# EAGLE design Nivel_superior (EAGLE 7.6.0)
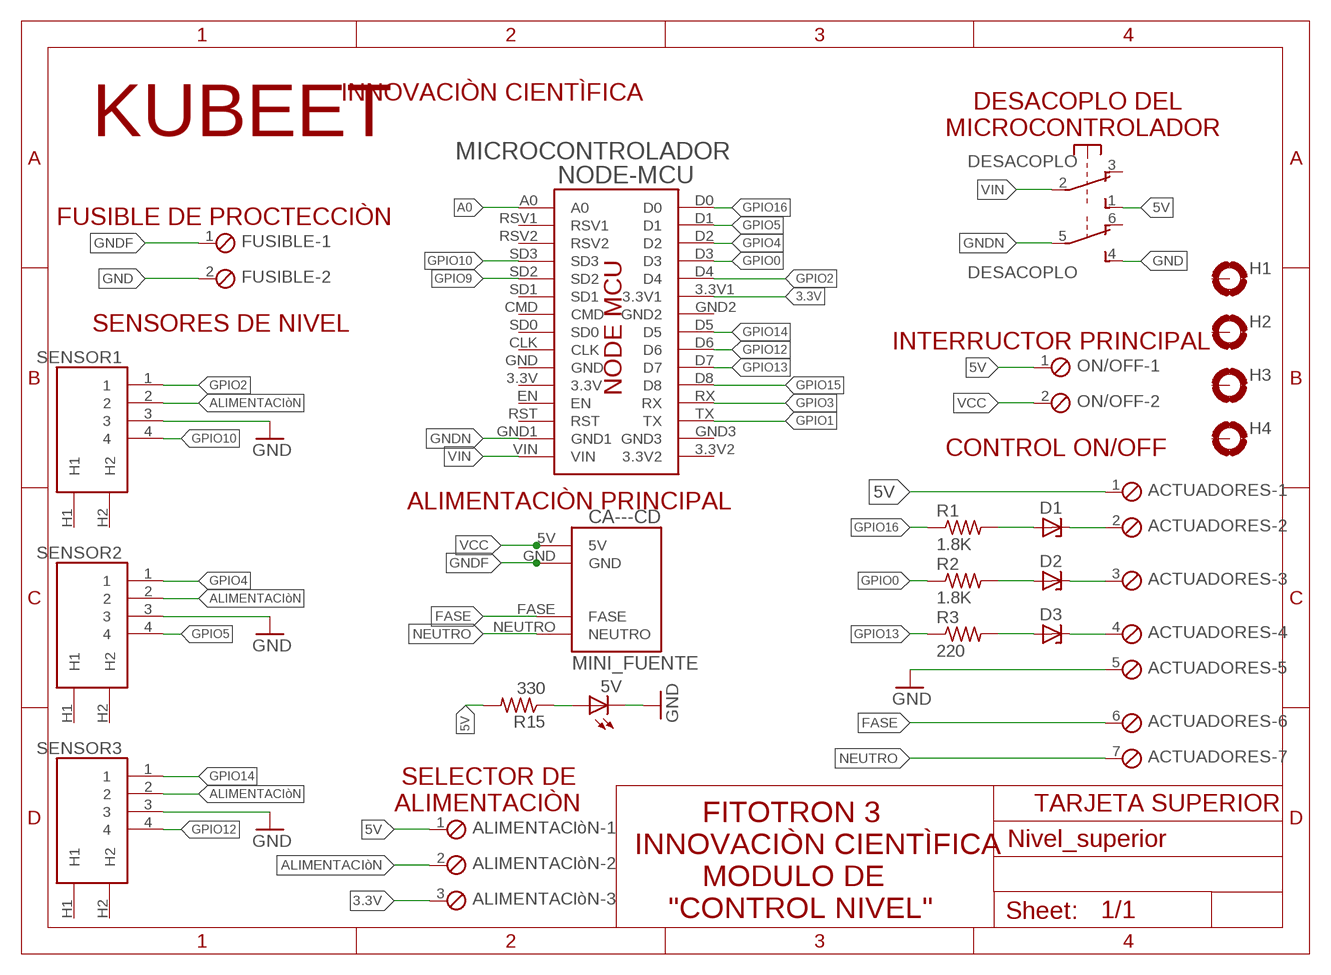
[diagram p0: schematic, sheet 1]

## Parts
5V  LED5MM  [LED5MM]
ACTUADORES  MPT7  [7POL254]
ALIMENTACIòN  MPT3  [3POL254]
CA---CD  MINI_FUENTE  MINI_FUENTE2  [MINI_FUENTE2]
D1  1N821  [DO35Z10]
D2  1N821  [DO35Z10]
D3  1N821  [DO35Z10]
DESACOPLO  9077-2  [9077-2]
FUSIBLE  MPT2  [2POL254]
H1  MOUNT-PAD-ROUND3.6  [3,6-PAD]
H2  MOUNT-PAD-ROUND3.6  [3,6-PAD]
H3  MOUNT-PAD-ROUND3.6  [3,6-PAD]
H4  MOUNT-PAD-ROUND3.6  [3,6-PAD]
MICROCONTROLADOR  NODE-MCU  [NODE-MCU]
ON/OFF  MPT2  [2POL254]
R1  1.8K  R-US_0207/7  [0207/7]
R2  1.8K  R-US_0207/7  [0207/7]
R3  220  R-US_0207/7  [0207/7]
R15  330  R-US_0207/7  [0207/7]
SENSOR1  RJ11  [RJ11]
SENSOR2  RJ11  [RJ11]
SENSOR3  RJ11  [RJ11]

## Nets
3.3V: ALIMENTACIòN.3 MICROCONTROLADOR.3.3V1
5V: ACTUADORES.1 ALIMENTACIòN.1 DESACOPLO.1(1:S) ON/OFF.1 R15.2
A0: MICROCONTROLADOR.A0
ALIMENTACIòN: ALIMENTACIòN.2 SENSOR1.2 SENSOR2.2 SENSOR3.2
FASE: ACTUADORES.6 CA---CD.FASE
GND: 5V.K(C) ACTUADORES.5 DESACOPLO.4(2:S) FUSIBLE.2 SENSOR1.3 SENSOR2.3 SENSOR3.3
GNDF: CA---CD.GND FUSIBLE.1
GNDN: DESACOPLO.5(2:P) MICROCONTROLADOR.GND1
GPIO0: MICROCONTROLADOR.D3 R2.1
GPIO1: MICROCONTROLADOR.TX
GPIO2: MICROCONTROLADOR.D4 SENSOR1.1
GPIO3: MICROCONTROLADOR.RX
GPIO4: MICROCONTROLADOR.D2 SENSOR2.1
GPIO5: MICROCONTROLADOR.D1 SENSOR2.4
GPIO9: MICROCONTROLADOR.SD2
GPIO10: MICROCONTROLADOR.SD3 SENSOR1.4
GPIO12: MICROCONTROLADOR.D6 SENSOR3.4
GPIO13: MICROCONTROLADOR.D7 R3.1
GPIO14: MICROCONTROLADOR.D5 SENSOR3.1
GPIO15: MICROCONTROLADOR.D8
GPIO16: MICROCONTROLADOR.D0 R1.1
N$5: D1.A R1.2
N$10: ACTUADORES.2 D1.C
N$13: D2.A R2.2
N$14: ACTUADORES.3 D2.C
N$18: 5V.A R15.1
N$22: D3.A R3.2
N$59: ACTUADORES.4 D3.C
NEUTRO: ACTUADORES.7 CA---CD.NEUTRO
VCC: CA---CD.5V ON/OFF.2
VIN: DESACOPLO.2(1:P) MICROCONTROLADOR.VIN
Unconnected: DESACOPLO.3(1:O) DESACOPLO.6(2:O) H1.B3,6(MOUNT) H2.B3,6(MOUNT) H3.B3,6(MOUNT) H4.B3,6(MOUNT) MICROCONTROLADOR.3.3V MICROCONTROLADOR.3.3V2 MICROCONTROLADOR.CLK MICROCONTROLADOR.CMD MICROCONTROLADOR.EN MICROCONTROLADOR.GND MICROCONTROLADOR.GND2 MICROCONTROLADOR.GND3 MICROCONTROLADOR.RST MICROCONTROLADOR.RSV1 MICROCONTROLADOR.RSV2 MICROCONTROLADOR.SD0 MICROCONTROLADOR.SD1 SENSOR1.H1 SENSOR1.H2 SENSOR2.H1 SENSOR2.H2 SENSOR3.H1 SENSOR3.H2

## Notes on the sheet
- INNOVACIÒN CIENTÌFICA
- KUBEET
- DESACOPLO DEL
  MICROCONTROLADOR
- FUSIBLE DE PROCTECCIÒN
- SENSORES DE NIVEL
- INTERRUCTOR PRINCIPAL
- CONTROL ON/OFF
- ALIMENTACIÒN PRINCIPAL
- SELECTOR DE 
  ALIMENTACIÒN
- TARJETA SUPERIOR
- FITOTRON 3
  INNOVACIÒN CIENTÌFICA
          MODULO DE 
      "CONTROL NIVEL"

## Library data of the parts
5V = led:LED: LED OSRAM: - CHIPLED LG R971, LG N971, LY N971, LG Q971, LY Q971, LO R971, LY R971 LH N974, LH R974 LS Q976, LO Q976, LY Q976 LO Q996 - Hyper CHIPLED LW Q18S LB Q993, LB Q99A, LB R99A - SideLED LS A670, LO A670, LY A670, LG A670, LP A670 LB A673, LV A673, LT A673, LW A673 LH A674 LY A675 LS A676, LA A676, LO A676, LY A676, LW A676 LS A679, LY A679, LG A679 - Hyper Micro SIDELED® LS Y876, LA Y876, LO Y876, LY Y876 LT Y87S - SmartLED LW L88C, LW L88S LB L89C, LB L89S, LG L890 LS L89K, LO L89K, LY L89K LS L896, LA L896, LO L896, LY L896 - TOPLED LS T670, LO T670, LY T670, LG T670, LP T670 LSG T670, LSP T670, LSY T670, LOP T670, LYG T670 LG T671, LOG T671, LSG T671 LB T673, LV T673, LT T673, LW T673 LH T674 LS T676, LA T676, LO T676, LY T676, LB T676, LH T676, LSB T676, LW T676 LB T67C, LV T67C, LT T67C, LS T67K, LO T67K, LY T67K, LW E67C LS E67B, LA E67B, LO E67B, LY E67B, LB E67C, LV E67C, LT E67C LW T67C LS T679, LY T679, LG T679 LS T770, LO T770, LY T770, LG T770, LP T770 LB T773, LV T773, LT T773, LW T773 LH T774 LS E675, LA E675, LY E675, LS T675 LS T776, LA T776, LO T776, LY T776, LB T776 LHGB T686 LT T68C, LB T68C - Hyper Mini TOPLED® LB M676 - Mini TOPLED Santana® LG M470 LS M47K, LO M47K, LY M47K Source: http://www.osram.convergy.de LUXEON: - LUMILED® LXK2-PW12-R00, LXK2-PW12-S00, LXK2-PW14-U00, LXK2-PW14-V00 LXK2-PM12-R00, LXK2-PM12-S00, LXK2-PM14-U00 LXK2-PE12-Q00, LXK2-PE12-R00, LXK2-PE12-S00, LXK2-PE14-T00, LXK2-PE14-U00 LXK2-PB12-K00, LXK2-PB12-L00, LXK2-PB12-M00, LXK2-PB14-N00, LXK2-PB14-P00, LXK2-PB14-Q00 LXK2-PR12-L00, LXK2-PR12-M00, LXK2-PR14-Q00, LXK2-PR14-R00 LXK2-PD12-Q00, LXK2-PD12-R00, LXK2-PD12-S00 LXK2-PH12-R00, LXK2-PH12-S00 LXK2-PL12-P00, LXK2-PL12-Q00, LXK2-PL12-R00 Source: www.luxeon.com KINGBRIGHT: KA-3528ASYC Source: www.kingbright.com
ACTUADORES = con-phoenix-254:MPT7: PHOENIX CONNECTOR; OC_FARNELL: unknown; OC_NEWARK: unknown
ALIMENTACIòN = con-phoenix-254:MPT3: PHOENIX CONNECTOR; OC_FARNELL: unknown; OC_NEWARK: unknown
CA---CD = CONECTORES RODAS:MINI_FUENTE2
D1-D3 = diode:1N821: Reference DIODE temperature compensated, 6,2 V
DESACOPLO = switch-misc:9077-2: MARQUARDT SWITCH 9077.0200 Distributor: Buerklin <https://www.buerklin.com/default.asp?event=ShowArtikel%2812G2822%29&l=d&jump=ArtNr_12G2822>
FUSIBLE ON/OFF = con-phoenix-254:MPT2: PHOENIX CONNECTOR; OC_FARNELL: unknown; OC_NEWARK: unknown
H1-H4 = holes:MOUNT-PAD-ROUND: MOUNTING PAD, round
MICROCONTROLADOR = Arduinos:NODE-MCU
R1-R3 R15 = rcl:R-US_: RESISTOR, American symbol
SENSOR1-SENSOR3 = CONECTORES RODAS:RJ11

## Board
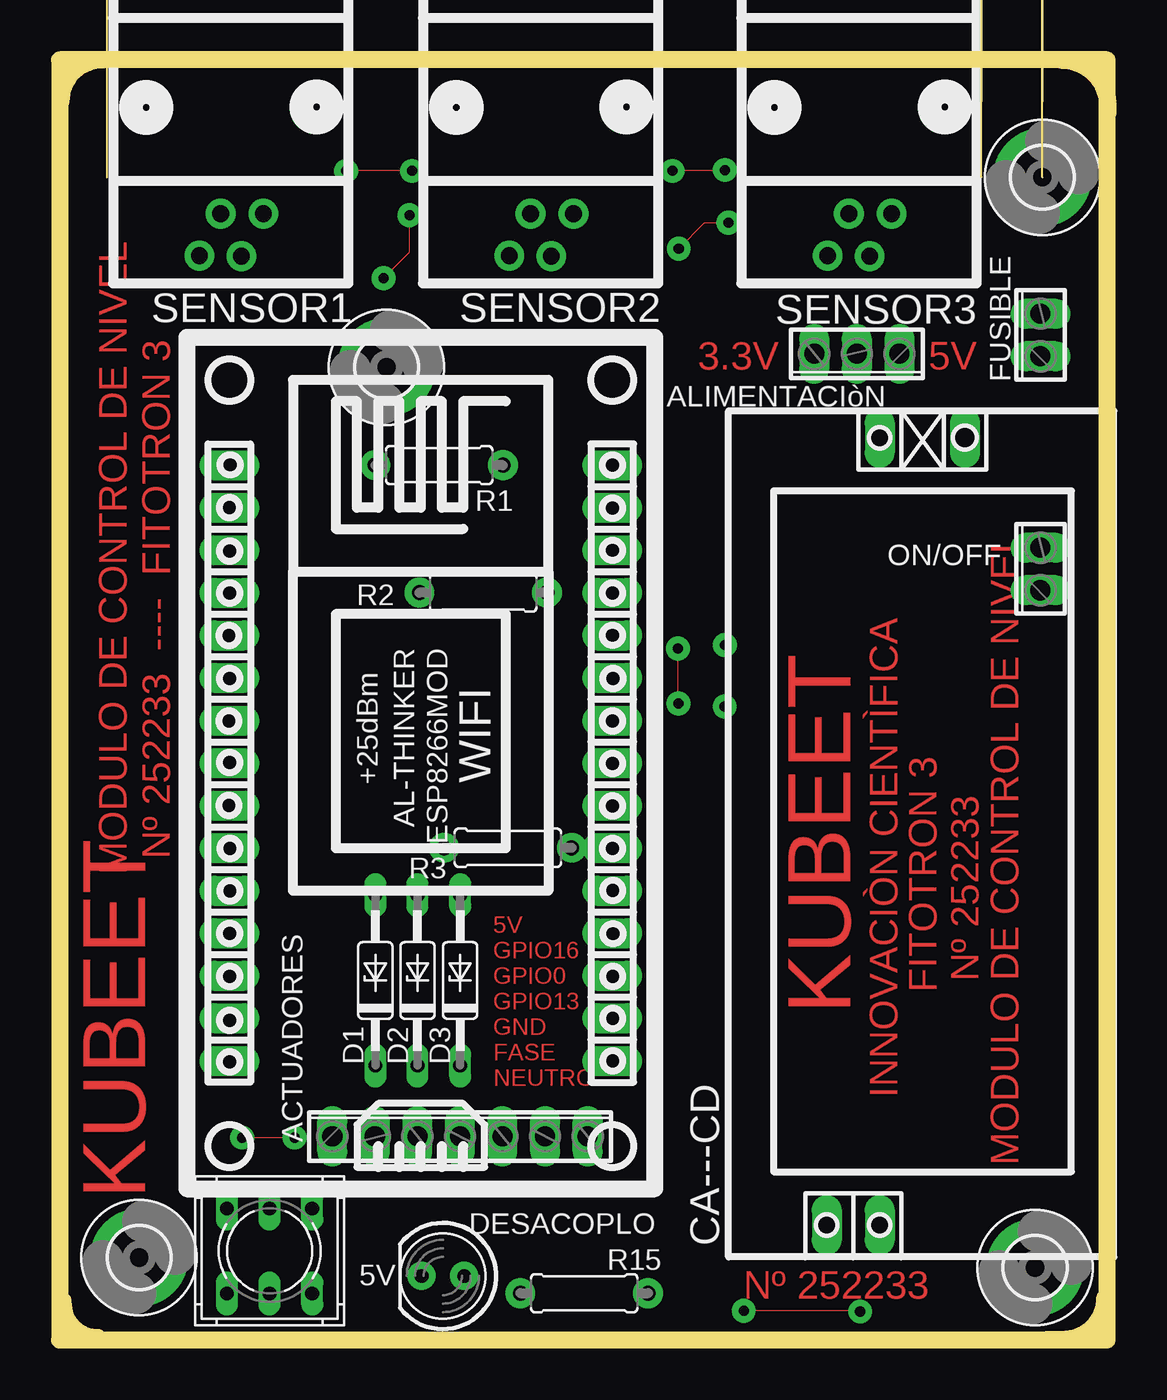
[diagram p1: board, top side]
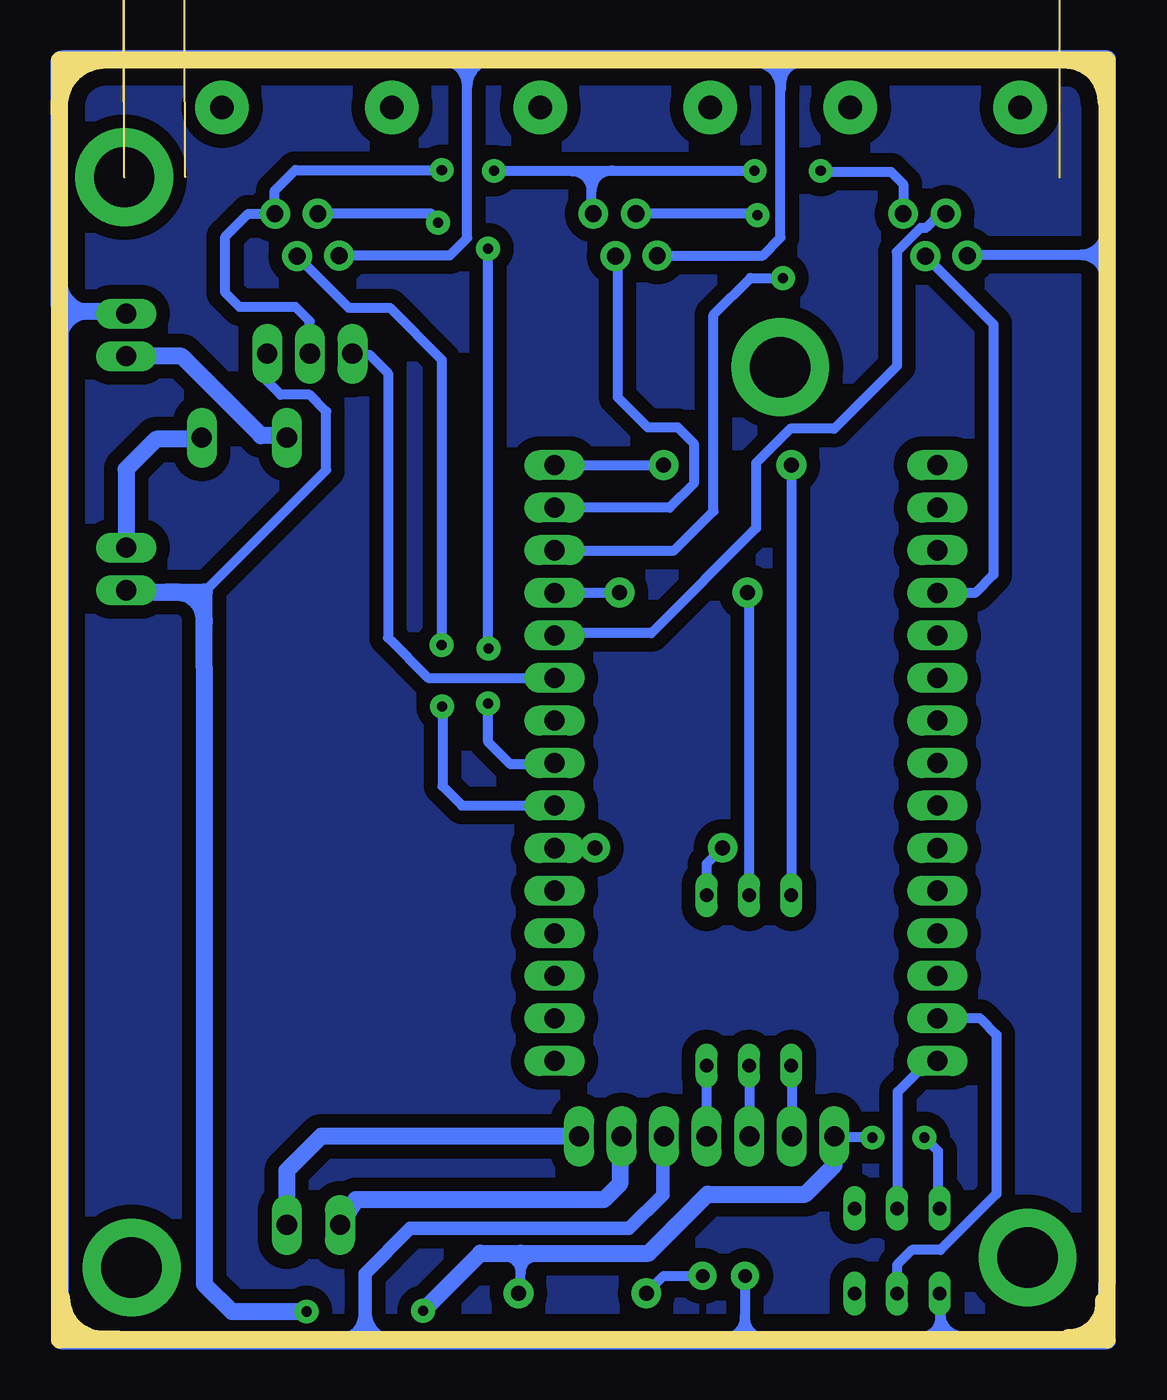
[diagram p2: board, bottom side, seen from below]

Size 62.57 x 76.4 mm. Coordinates in mm from the lower left corner, seen from the top.
Outline: 58.93,0.02 59.88,0.02 arc90 62.4,2.54
Outline: 0.2,2.35 0.2,2.21 arc90 2.29,0.12
Outline: 2.6,76.39 2.54,76.39 arc90 0.07,73.93
Outline: 59.76,76.38 arc-90 62.57,73.57 62.57,73.22
Outline: 0,0 62.52,0 62.52,76.4 0,76.4 0,0
Copper layers (1*16): Top 0.035mm / dielectric 1.5mm / Bottom 0.035mm
Design rules "default": minimum track width 10mil, minimum drill 24mil, track to track 8mil, track to pad 8mil, pad to pad 8mil, via to via 8mil, smd to smd 8mil, copper to edge 40mil, drill to drill 8mil, minimum pad ring 10mil, minimum via ring 8mil, stop-mask expansion 4mil, vias tented up to drill 0mil, thermal gap 10mil
Milling: area 57.2,83.1 to 58.7,83.7; area 2.8,83.1 to 4.3,83.7; area 27.3,81.2 to 34.2,83; area 57.2,87.1 to 58.7,87.7; area 55.1,87.1 to 56.6,87.7; area 54.1,85.2 to 59.7,87; 6 lines

### Footprints (pad centres in the part's own frame; a part is rotated, then mirrored left to right if it is on the bottom)
LED5MM = drill 0.813 pad 1.676: A -1.27,0; K 1.27,0
7POL254 = drill 1.2 long: 1 -7.62,0; 2 -5.08,0; 3 -2.54,0; 4 0,0; 5 2.54,0; 6 5.08,0; 7 7.62,0
3POL254 = drill 1.2 long: 1 -2.54,0; 2 0,0; 3 2.54,0
MINI_FUENTE2 = drill 1.2 pad 1.676 long: 5V 48.895,8.89; FASE 1.905,17.145; GND 48.895,13.97; NEUTRO 1.905,13.97
DO35Z10 = drill 0.813 long: A 5.08,0; C -5.08,0
9077-2 = drill 0.813 long: 1 -2.54,2.54; 2 0,2.54; 3 2.54,2.54; 4 -2.54,-2.54; 5 0,-2.54; 6 2.54,-2.54
2POL254 = drill 1.2 long: 1 -1.27,0; 2 1.27,0
3,6-PAD = drill 3.6 pad 5.842: B3,6 0,0
NODE-MCU = drill 1.2 pad 1.676 long: 3.3V 2.54,17.78; 3.3V1 25.4,30.48; 3.3V2 25.4,7.62; A0 2.54,43.18; CLK 2.54,22.86; CMD 2.54,27.94; D0 25.4,43.18; D1 25.4,40.64; D2 25.4,38.1; D3 25.4,35.56; D4 25.4,33.02; D5 25.4,25.4; D6 25.4,22.86; D7 25.4,20.32; D8 25.4,17.78; EN 2.54,15.24; GND 2.54,20.32; GND1 2.54,10.16; GND2 25.4,27.94; GND3 25.4,10.16; RST 2.54,12.7; RSV1 2.54,40.64; RSV2 2.54,38.1; RX 25.4,15.24; SD0 2.54,25.4; SD1 2.54,30.48; SD2 2.54,33.02; SD3 2.54,35.56; TX 25.4,12.7; VIN 2.54,7.62
0207/7 = drill 0.9 pad 1.778: 1 -3.81,0; 2 3.81,0
RJ11 = drill 1 pad 1.778: 1 6.426,4.153; 2 8.979,4.153; 3 5.156,1.651; 4 7.658,1.626 | drill 1.4 pad 3.2: H1 1.994,10.503; H2 12.141,10.503

### Placement (x,y rotation side)
5V  22.87,3.81 180 top
ACTUADORES  23.9,12.14 0 top
ALIMENTACIòN  47.59,58.86 180 top
CA---CD  62.93,4.95 90 top
D1  18.84,21.45 90 top
D2  21.36,21.45 90 top
D3  23.9,21.45 90 top
DESACOPLO  12.53,5.3 0 top
FUSIBLE  58.55,59.98 90 top
H1  4.74,4.91 0 top
H2  58.23,4.31 0 top
H3  58.66,69.39 0 top
H4  19.51,58.05 0 top
MICROCONTROLADOR  7.58,9.03 0 top
ON/OFF  58.55,46.01 90 top
R1  22.66,52.21 180 top
R2  25.28,44.6 180 top
R3  26.76,29.37 180 top
R15  31.31,2.78 0 top
SENSOR1  3.19,63.06 0 top
SENSOR2  21.69,63.06 0 top
SENSOR3  40.69,63.06 0 top

### Tracks (layer width: path | path; a pad name or v marks a point on that pad's centre or on a via)
3.3V
  Bottom 0.61: ALIMENTACIòN.3 44.98,58.8 44.03,58.8 42.93,57.69 42.93,41.91 40.52,39.51 MICROCONTROLADOR.3.3V1
5V  (via drill 0.6 pad 1.42)
  Top 0: v47.78,1.69 47.73,1.74 v40.83,1.74 | v10.89,12.07 v14.02,12.07
  Bottom 0.61: R15.2 35,2.9 35,5.17 | DESACOPLO.1 10.08,7.93 10.08,11.26 v10.89,12.07 | v10.89,12.07 | v14.02,12.07 16.21,12.07 arc90 ACTUADORES.1 | 50.01,58.68 50.16,58.83 ALIMENTACIòN.1 50.13,57.21 49.34,56.42 47.61,56.42 46.61,55.42 46.61,51.93 53.89,44.64
  Bottom 1.016: v47.78,1.69 52.25,1.69 53.88,3.32 53.88,40.07 53.89,40.09 53.89,44.64 58.45,44.64 ON/OFF.1 | v40.83,1.74 37.41,5.17 35,5.17 27.36,5.17 23.84,8.69 18.01,8.69 16.28,10.42 ACTUADORES.1
ALIMENTACIòN  (via drill 0.6 pad 1.42)
  Top 0: v39.71,69.83 39.66,69.77 v36.59,69.77 | v21.03,69.77 v17.09,69.77
  Bottom 0.61: v39.71,69.83 48.46,69.83 49.68,68.6 49.68,67.23 SENSOR3.2 51.26,67.21 52.63,65.84 52.63,62.51 51.78,61.65 48.44,61.65 47.59,60.8 ALIMENTACIòN.2 | v36.59,69.77 30.77,69.77 | 30.77,69.77 v21.03,69.77 | v17.09,69.77 17.04,69.72 12.9,69.72 12.17,68.99 SENSOR1.2 | SENSOR2.2 30.77,67.32 30.77,69.77
FASE
  Bottom 1.016: ACTUADORES.6 29.08,12.04 29.08,9.32 30.04,8.36 44.84,8.36 CA---CD.FASE
GND
  Bottom 0.61: 5V.K 21.6,-0.05 | DESACOPLO.4 9.97,2.74 9.97,-0.05 | 8.34,64.7 SENSOR1.3 8.29,64.76 -0.05,64.76 | 26.81,64.68 SENSOR2.3 26.83,64.72 20.55,64.72 19.49,65.79 19.49,76.46 | SENSOR3.3 45.81,64.74 39.22,64.74 38.19,65.77 38.19,76.46
  Bottom 0.813: ACTUADORES.5 26.5,12.08 26.5,8.67 28.53,6.64 41.6,6.64 44.3,3.94 44.3,-0.05 | 60.63,61.35 60.71,61.35 arc-90 62.5,59.55
  Bottom 1.016: FUSIBLE.2 58.68,61.38 62.25,61.38 62.5,61.13 62.5,59.55 62.5,-0.01 62.46,-0.05 44.3,-0.05 21.6,-0.05 9.97,-0.05 -0.05,-0.05 0.01,0 0.01,3.38 -0.05,3.43 -0.05,64.76 -0.05,76.46 -0.04,76.46 19.49,76.46 38.19,76.46 62.38,76.46 62.57,76.27 62.57,61.79
GNDF
  Bottom 1.016: CA---CD.GND 49.08,53.97 50.5,53.97 55.25,58.71 FUSIBLE.1
GNDN
  Bottom 0.61: MICROCONTROLADOR.GND1 10.11,19.2 7.59,19.2 6.6,18.21 6.6,8.7 9.94,5.37 11.64,5.37 12.53,4.47 DESACOPLO.5
GPIO0
  Bottom 0.61: R2.1 29.11,44.59 MICROCONTROLADOR.D3
GPIO2
  Bottom 0.61: SENSOR1.1 9.98,67.21 10.82,66.37 11.14,66.37 12.55,64.95 12.55,58.11 16.28,54.38 18.9,54.38 20.94,52.34 20.94,48.44 27.2,42.19 32.84,42.19 MICROCONTROLADOR.D4
GPIO4  (via drill 0.6 pad 1.42)
  Top 0: v19.35,63.38 20.88,64.91 v20.88,67.14
  Bottom 0.61: MICROCONTROLADOR.D2 32.97,47.11 25.84,47.11 23.49,49.47 23.49,61.18 21.29,63.38 v19.35,63.38 | v20.88,67.14 20.98,67.21 SENSOR2.1
GPIO5
  Bottom 0.61: SENSOR2.4 29.22,64.56 29.22,56.27 27.43,54.48 25.64,54.48 24.67,53.51 24.67,51.1 26.1,49.67 MICROCONTROLADOR.D1
GPIO10
  Bottom 0.61: SENSOR1.4 6.78,60.62 6.78,45.67 7.87,44.59 MICROCONTROLADOR.SD3
GPIO12  (via drill 0.6 pad 1.42)
  Top 0: v39.72,41.47 39.7,41.45 v39.7,37.8
  Bottom 0.61: SENSOR3.4 45.26,61.6 42.81,61.6 39.72,58.5 v39.72,41.47 | v39.7,37.8 39.67,37.78 39.67,33.05 38.51,31.89 MICROCONTROLADOR.D6
GPIO13
  Bottom 0.61: R3.1 30.59,29.35 MICROCONTROLADOR.D7
GPIO14  (via drill 0.6 pad 1.42)
  Top 0: v36.95,37.97 36.91,38.25 v36.91,41.27 | v36.95,65.14 38.5,66.68 v39.93,66.68
  Bottom 0.61: MICROCONTROLADOR.D5 33.06,34.35 35.6,34.35 36.95,35.7 v36.95,37.97 | v36.91,41.27 36.95,41.31 v36.95,65.14 | v39.93,66.68 40.31,67.21 SENSOR3.1
GPIO16
  Bottom 0.61: MICROCONTROLADOR.D0 R1.1
N$1
  pour Bottom (isolate 0.813): 0.13,-0.12 62.56,-0.12 62.56,76.58 -0.25,76.58 -0.25,2.14
N$5
  Bottom 0.61: R1.2 D1.A
N$10
  Bottom 0.61: D1.C 18.82,16.34 ACTUADORES.2
N$13
  Bottom 0.61: R2.2 21.36,44.49 D2.A
N$14
  Bottom 0.61: D2.C ACTUADORES.3
N$17
  Bottom 0.61: 8.22,0.2 8.57,0.2 arc90 9.94,1.57 9.94,1.41 arc90 11.26,0.1
N$18
  Bottom 0.61: R15.1 26.47,3.81 5V.A
N$22
  Bottom 0.61: R3.2 23.9,28.41 D3.A
N$59
  Bottom 0.61: D3.C 23.9,16.36 ACTUADORES.4
N$66
  Bottom 0.813: 41.11,-0.16 42.47,-0.16 arc90 44.29,1.66 44.29,1.51 arc90 45.84,-0.05
N$67
  Bottom 0.813: 60.59,61.4 60.67,61.4 arc90 62.46,63.18
N$68
  Bottom 0.61: 19.5,0.01 20.22,0.01 arc90 21.62,1.41 21.62,1.37 arc90 22.93,0.05
N$74
  Bottom 0.61: 33.96,4.98 34.01,4.98 arc-90 35,3.99 arc-90 36.03,5.02 36.66,5.02
N$79
  Bottom 0.61: 29.51,69.79 29.57,69.79 arc-90 30.77,68.59 arc-90 31.93,69.75 31.94,69.75
N$86
  Bottom 0.61: 18.14,76.26 arc-90 19.47,74.93 19.47,74.62 arc-90 21.13,76.28
N$87
  Bottom 0.61: 36.4,76.45 36.48,76.45 arc-90 38.21,74.73 38.21,74.83 arc-90 39.73,76.35
N$88
  Bottom 0.61: 0.09,66.58 0.09,66.27 arc90 1.6,64.76 arc90 0.11,63.27 0.11,62.97
N$91
  Bottom 1.016: 53.89,42.82 arc-90 55.41,44.62 56.18,44.62
NEUTRO
  Bottom 1.016: ACTUADORES.7 46.9,12.15 48.96,10.09 CA---CD.NEUTRO
VCC
  Bottom 1.016: CA---CD.5V 54.12,53.76 56.75,53.76 58.55,51.96 ON/OFF.2
VIN
  Bottom 0.61: DESACOPLO.2 12.49,7.89 12.49,14.8 10.65,16.65 MICROCONTROLADOR.VIN

### Text on the board
Top: 3.3V | 5V | MODULO DE CONTROL DE NIVEL | Nº 252233 ---- FITOTRON 3 | FITOTRON 3 / Nº 252233 | KUBEET | 5V / GPIO16 / GPIO0 / GPIO13 / GND / FASE / NEUTRO | INNOVACIÒN CIENTÌFICA | MODULO DE CONTROL DE NIVEL | KUBEET | Nº 252233